# EAGLE design encoder-switch-type1-tht (EAGLE 9.2.0)
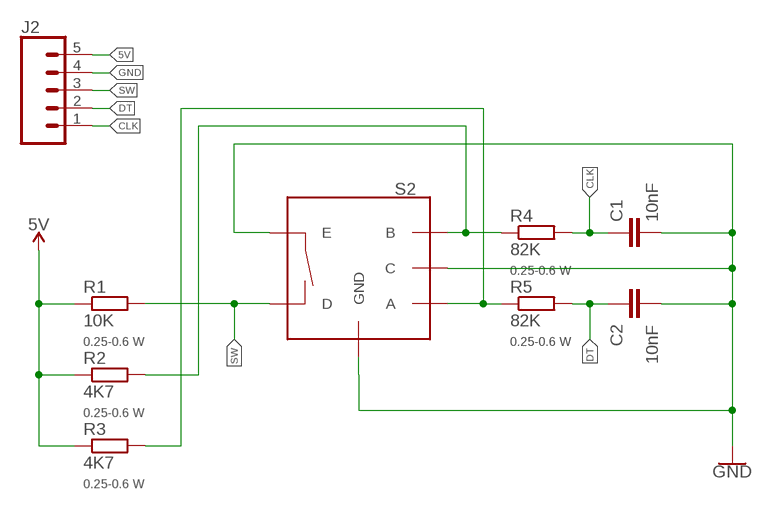
[diagram p0: schematic, sheet 1]

## Parts
C1  10nF  CAPACITOR_1025-024X044  [C025-024X044]
C2  10nF  CAPACITOR_1025-024X044  [C025-024X044]
J2  CONN_051X05LA  [1X05/90]
R1  10K  RESISTOR0204/2V  [0204V]
R2  4K7  RESISTOR0204/2V  [0204V]
R3  4K7  RESISTOR0204/2V  [0204V]
R4  82K  RESISTOR0204/2V  [0204V]
R5  82K  RESISTOR0204/2V  [0204V]
S2  ENCODER_SWITCH  [ROTARY_ENC_PLAIN]

## Nets
5V: J2.5 R1.1 R2.1 R3.1
CLK: C1.1 J2.1 R4.2
DT: C2.1 J2.2 R5.2
GND: C1.2 C2.2 J2.4 S2.C S2.E S2.GND1(GND) S2.GND2(GND)
N$3: R2.2 R4.1 S2.B
N$4: R3.2 R5.1 S2.A
SW: J2.3 R1.2 S2.D

## Library data of the parts
C1 C2 = 006-rcl:CAPACITOR_1: CAPACITOR, European symbol; SPICEPREFIX: C
J2 = 001-private-inventory:CONN_05: Multi connection point. Often used as Generic Header-pin footprint for 0.1 inch spaced/style header connections On any of the 0.1 inch spaced packages, you can populate with these: Break Away Headers - Straight <https://www.sparkfun.com/products/116> (PRT-00116) Break Away Male Headers - Right Angle <https://www.sparkfun.com/products/553> (PRT-00553) Female Headers <https://www.sparkfun.com/products/115> (PRT-00115) Break Away Headers - Machine Pin <https://www.sparkfun.com/products/117> (PRT-00117) Break Away Female Headers - Swiss Machine Pin <https://www.sparkfun.com/products/743> (PRT-00743) For SCREWTERMINALS and SPRING TERMINALS visit here: Screw Terimnals on SparkFun.com <https://www.sparkfun.com/search/results?term=Screw+Terminals> (5mm/3.5mm/2.54mm spacing) This device is also useful as a general connection point to wire up your design to another part of your project. Our various solder wires solder well into these plated through hole pads. Hook-Up Wire - Assortment (Stranded, 22 AWG) <https://www.sparkfun.com/products/11375> (PRT-11375) Hook-Up Wire - Assortment (Solid Core, 22 AWG) <https://www.sparkfun.com/products/11367> (PRT-11367) View the entire wire category on our website here <https://www.sparkfun.com/categories/141> Special notes: Molex polarized connector foot print use with SKU : PRT-08231 with associated crimp pins and housings. 1MM SMD Version SKU: PRT-10208
R1-R5 = 006-rcl:RESISTOR: RESISTOR, European symbol; POWER: 0.25-0.6 W; SPICEPREFIX: R
S2 = 010-inputs:ENCODER_SWITCH: Rotary Encoder w/ Select Switch Encoders rotate similarly to potentiometers, but they’re different from potentiometers in that an encoder has full rotation without limits. They output gray code so that you can tell how much and in which direction the encoder has been turned. This encoder includes a push-down select switch built into the shaft. SparkFun Products Rotary Encoder <https://www.sparkfun.com/products/9117> (COM-09117); SF_SKU: COM-09117

## Board
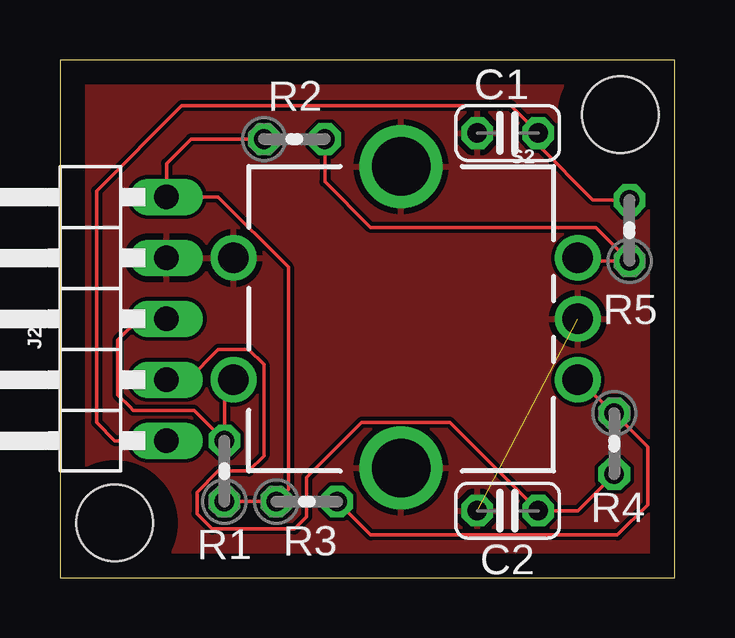
[diagram p1: board, top side]
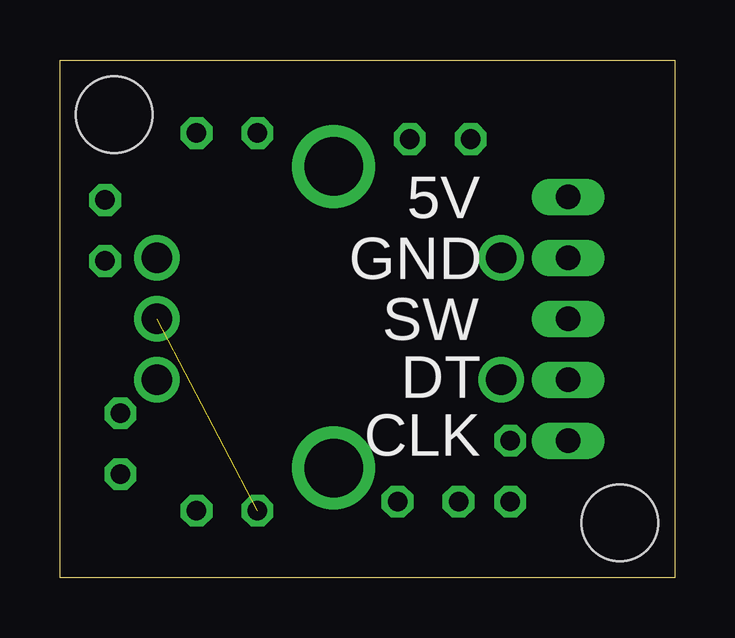
[diagram p2: board, bottom side, seen from below]

Size 25.63 x 21.59 mm. Coordinates in mm from the lower left corner, seen from the top.
Outline: 0,0 25.63,0 25.63,21.59 0,21.59 0,0
Copper layers (1*16): Top 0.035mm / dielectric 1.5mm / Bottom 0.035mm
Design rules "default": minimum track width 6mil, minimum drill 0.35mm, track to track 6mil, track to pad 6mil, pad to pad 6mil, via to via 6mil, smd to smd 6mil, copper to edge 40mil, drill to drill 6mil, minimum pad ring 10mil, minimum via ring 8mil, stop-mask expansion 4mil, vias tented up to drill 0mil, thermal gap 10mil
Holes 3.2 mm at 2.29,2.29 23.37,19.3

### Footprints (pad centres in the part's own frame; a part is rotated, then mirrored left to right if it is on the bottom)
C025-024X044 = drill 0.813 octagon: 1 -1.27,0; 2 1.27,0
1X05/90 = drill 1.016 long: 1 -5.08,-3.81; 2 -2.54,-3.81; 3 0,-3.81; 4 2.54,-3.81; 5 5.08,-3.81
0204V = drill 0.813 octagon: 1 -1.27,0; 2 1.27,0
ROTARY_ENC_PLAIN = drill 1.27: A 7.366,-2.54; B 7.366,2.54; C 7.366,0; D -6.985,-2.54; E -6.985,2.54 | drill 2.438: GND1 0,6.35; GND2 0,-6.223

### Placement (x,y rotation side)
C1  18.67,18.54 180 top
C2  18.67,2.79 180 top
J2  0.64,10.79 90 top
R1  6.86,4.45 90 top
R2  9.78,18.29 0 top
R3  10.29,3.17 0 top
R4  23.75,14.48 90 top
R5  23.11,5.59 270 top
S2  14.22,10.79 0 top

### Tracks (layer width: path | path; a pad name or v marks a point on that pad's centre or on a via)
5V
  Top 0.152: R2.1 5.46,18.29 4.45,17.27 J2.5 6.6,15.88 9.53,12.95 9.53,3.68 R3.1 R1.1
CLK
  Top 0.152: R4.2 22.23,15.75 19.94,18.03 C1.1 18.8,19.68 7.87,19.68 5.08,19.68 1.52,16.13 1.52,6.48 2.29,5.71 J2.1
DT
  Top 0.152: R5.2 21.59,2.79 C2.1 16.26,6.48 12.57,6.48 10.29,4.19 10.29,2.54 9.78,2.03 6.35,2.03 5.71,2.67 5.71,3.56 6.6,4.45 7.87,4.45 8.51,5.08 8.51,8.89 7.87,9.53 6.6,9.53 5.33,8.26 J2.2
GND  (1 unrouted)
  pour Top: 0,21.59 25.65,21.59 25.65,0 0,0
N$3
  Top 0.152: S2.B 21.84,13.21 R4.1 22.35,14.61 12.95,14.61 11.05,16.51 R2.2
N$4
  Top 0.152: S2.A R5.1 24.51,5.46 24.51,3.05 23.24,1.78 19.3,1.78 12.95,1.78 R3.2
SW
  Top 0.152: S2.D 6.86,7.87 R1.2 5.59,6.99 3.05,6.99 2.92,7.11 2.41,7.62 2.41,9.91 3.3,10.79 J2.3

### Text on the board
bPlace: 5V | GND | SW | DT | CLK